# Altium schematic sheet ECG FILTER.SchDoc
size A
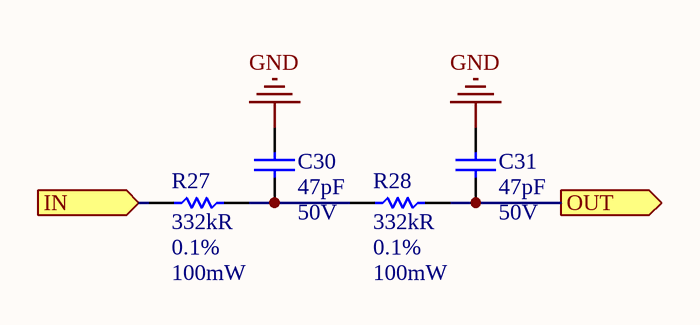
[diagram p0: ECG FILTER.SchDoc]

## Parts
C30  Capacitance: 47pF  Voltage Rating: 50V  [0402 CAPACITOR]  (hidden comment: MCMT15N470F500CT)
C31  Capacitance: 47pF  Voltage Rating: 50V  [0402 CAPACITOR]  (hidden comment: MCMT15N470F500CT)
R27  Resistance: 332kR  Tolerance: 0.1%  Power Rating: 100mW  [MCT06030E3323BP100]  (hidden comment: MCT06030E3323BP100)
R28  Resistance: 332kR  Tolerance: 0.1%  Power Rating: 100mW  [MCT06030E3323BP100]  (hidden comment: MCT06030E3323BP100)

## Ports
IN (in), OUT (out)

## Nets
GND: C30.2 C31.2
IN: R27.1 ; port IN
OUT: C31.1 R28.2 ; port OUT
NetC30_1: C30.1 R27.2 R28.1

## Library data of the parts
C30 C31 = CMP-001-00088-3: Cap Ceramic 47pF 50V C0G 1% SMD 0402 125°C; Dielectric: C0G; Case Code (Metric): 1005; Max Operating Temperature: 125°C; Case/Package: 0402; Tolerance: 1%; Voltage Rating (DC): 50V; REACH SVHC: No SVHC; Packaging: Cut Tape; Case Code (Imperial): 0402; Min Operating Temperature: -55°C
R27 R28 = CMP-009-00191-2: Surface Mount Thin Film Resistor, Mct Series, 332 Kohm, 100 Mw, - 0.1%, 75 V Rohs Compliant: Yes; Voltage Rating: 75V; Composition: Thin Film; Voltage Rating (DC): 75V; REACH SVHC: Unknown; Lead Free: Lead Free; Packaging: Cut Tape; Case Code (Metric): 1608; Case Code (Imperial): 0603; Mount: Surface Mount; Case/Package: 0603